# Altium schematic sheet XMOD.schdoc: TEBF0808 - XMOD JTAG
size A4; DocumentNumber: TEBF0808; Revision: 04; SheetNumber: 29; SheetTotal: 36; Date: 2016-09-29; CompanyName: Trenz Electronic GmbH; Organization: Trenz Electronic GmbH
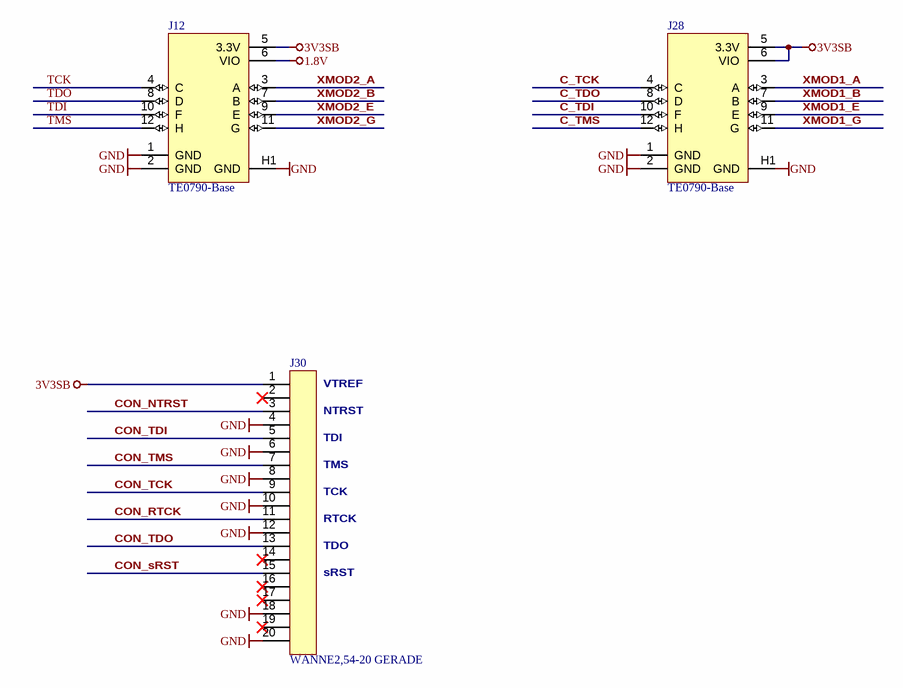
[diagram p0: XMOD.schdoc]

## Parts
J12  TE0790-Base  [TE0790-Base]
J28  TE0790-Base  [TE0790-Base]
J30  WANNE2,54-20 GERADE  [WANNE2,54-20 GERADE]

## Nets
1.8V: J12.6(VIO)
3V3SB: J12.5(3.3V) J28.5(3.3V) J28.6(VIO) J30.1
GND: J12.1(GND) J12.2(GND) J12.H1(GND) J28.1(GND) J28.2(GND) J28.H1(GND) J30.4 J30.6 J30.8 J30.10 J30.12 J30.18 J30.20
C_TCK: J28.4(C)
C_TDI: J28.10(F)
C_TDO: J28.8(D)
C_TMS: J28.12(H)
CON_NTRST: J30.3
CON_RTCK: J30.11
CON_sRST: J30.15
CON_TCK: J30.9
CON_TDI: J30.5
CON_TDO: J30.13
CON_TMS: J30.7
TCK: J12.4(C)
TDI: J12.10(F)
TDO: J12.8(D)
TMS: J12.12(H)
XMOD1_A: J28.3(A)
XMOD1_B: J28.7(B)
XMOD1_E: J28.9(E)
XMOD1_G: J28.11(G)
XMOD2_A: J12.3(A)
XMOD2_B: J12.7(B)
XMOD2_E: J12.9(E)
XMOD2_G: J12.11(G)

Not connected (* = marked no-connect by the designer): J30 2* 14* 16* 17* 19*

## Notes on the sheet
- (near J30) VTREF
- (near J30) TDI
- (near J30) NTRST
- (near J30) TMS
- (near J30) TCK
- (near J30) RTCK
- (near J30) TDO
- (near J30) sRST
- Title:
- Number:
- Rev.
- Date:
- A4
- Copyright:
- Page
- of
- Filename:

## Library data of the parts
J12 J28 = 26694: AN: 26694; Mixed: THT; Trenz-Article-Number: 22495
J30 = 20127: Stiftleiste Wanne 20polig; AN: 20127; Trenz-Stock: Yes; Mixed: THT; HelpURL: B:\AD\adlib\datasheet\137